# Altium project PCB_Project.PrjPcb
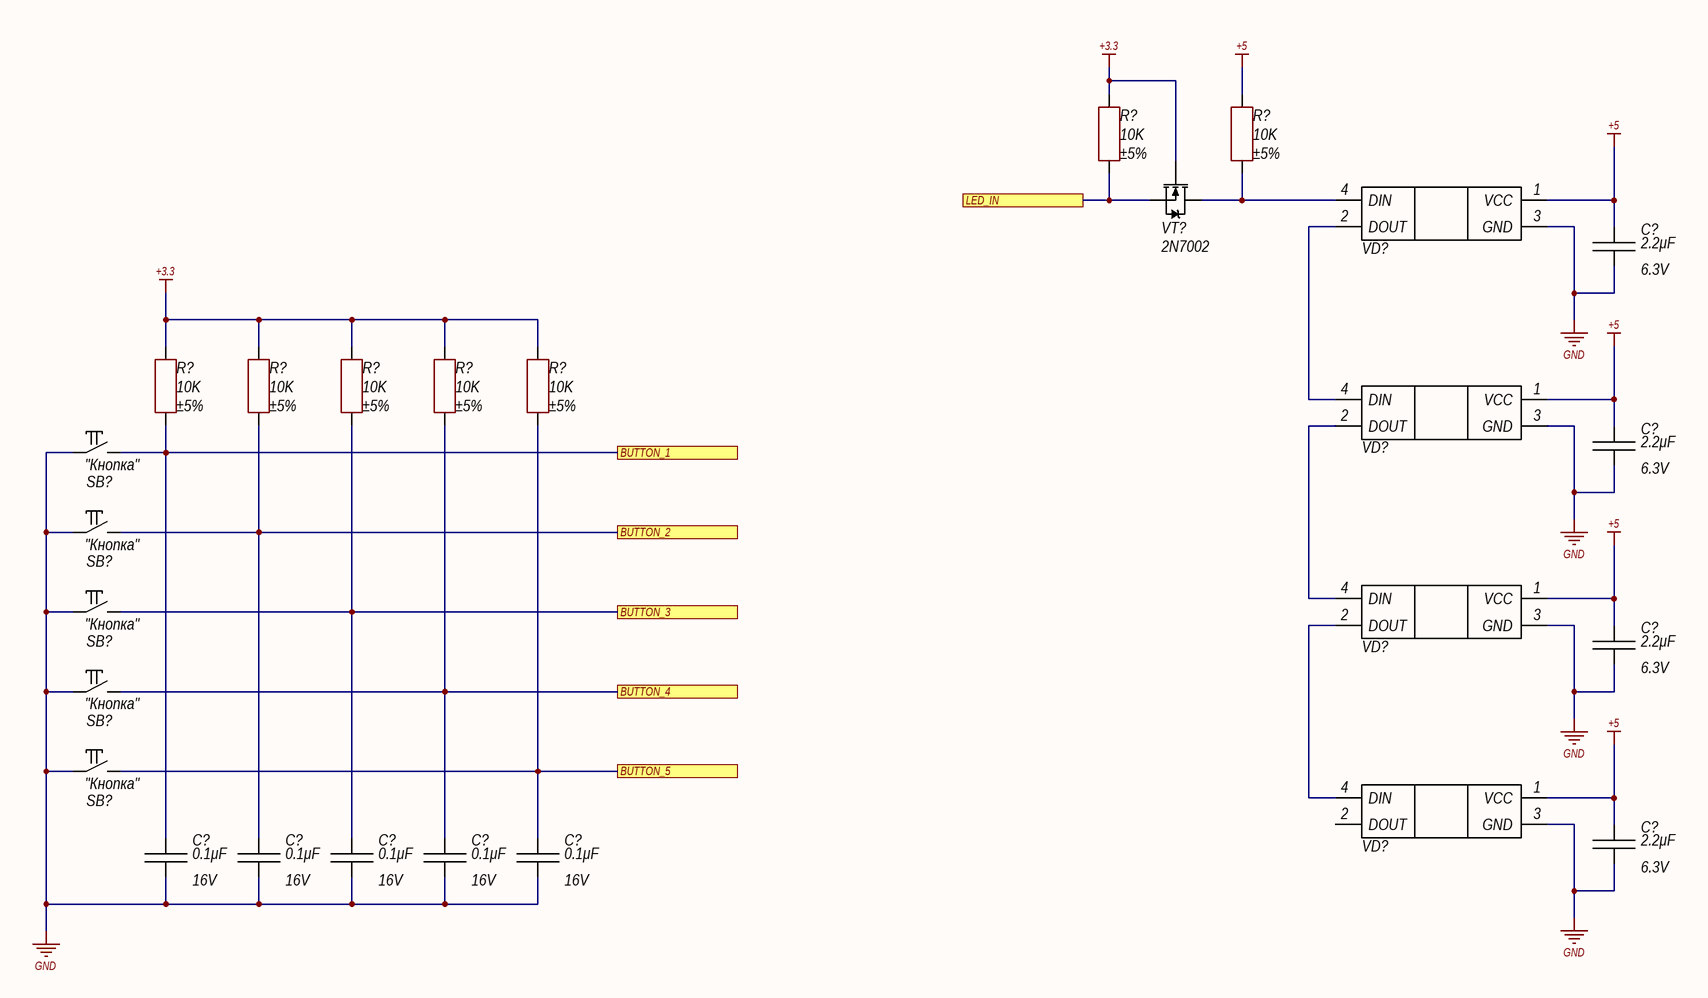
[diagram p0: Sheet1.SchDoc]
2 sheets, 27 parts. Net scope: flat (ports and power ports of the same name join across sheets).
Sheets:
  Sheet1.SchDoc
  Sheet2.SchDoc

## Sheet Sheet1.SchDoc
size 420 x 297 mm; SheetNumber: 1; SheetTotal: 1

### Parts
(Parts that share a designator on the sheet are numbered #1, #2 ... from top to bottom, then left to right.)
C?#1  value 2.2μF  Voltage: 6.3V  [CAP: 0402]
C?#2  value 2.2μF  Voltage: 6.3V  [CAP: 0402]
C?#3  value 2.2μF  Voltage: 6.3V  [CAP: 0402]
C?#4  value 2.2μF  Voltage: 6.3V  [CAP: 0402]
C?#5  value 0.1μF  Voltage: 16V  [CAP: 0402]
C?#6  value 0.1μF  Voltage: 16V  [CAP: 0402]
C?#7  value 0.1μF  Voltage: 16V  [CAP: 0402]
C?#8  value 0.1μF  Voltage: 16V  [CAP: 0402]
C?#9  value 0.1μF  Voltage: 16V  [CAP: 0402]
R?#1  value 10K  Tolerance: ±5%  [RES: 0402]
R?#2  value 10K  Tolerance: ±5%  [RES: 0402]
R?#3  value 10K  Tolerance: ±5%  [RES: 0402]
R?#4  value 10K  Tolerance: ±5%  [RES: 0402]
R?#5  value 10K  Tolerance: ±5%  [RES: 0402]
R?#6  value 10K  Tolerance: ±5%  [RES: 0402]
R?#7  value 10K  Tolerance: ±5%  [RES: 0402]
SB?#1  CommentText: "Кнопка"  [BUT: 5X5 SMD]
SB?#2  CommentText: "Кнопка"  [BUT: 5X5 SMD]
SB?#3  CommentText: "Кнопка"  [BUT: 5X5 SMD]
SB?#4  CommentText: "Кнопка"  [BUT: 5X5 SMD]
SB?#5  CommentText: "Кнопка"  [BUT: 5X5 SMD]
VD?#1  (no value)  [WS2812B]
VD?#2  (no value)  [WS2812B]
VD?#3  (no value)  [WS2812B]
VD?#4  (no value)  [WS2812B]
VT?  PartNumber: 2N7002  [SOT23]

### Ports
BUTTON_1, BUTTON_2, BUTTON_3, BUTTON_4, BUTTON_5, LED_IN

### Nets
+3.3: R?#1.2 R?#3.2 R?#4.2 R?#5.2 R?#6.2 R?#7.2 VT?.1(G)
+5: C?#1.2 C?#2.2 C?#3.2 C?#4.2 R?#2.2 VD?#1.1(VCC) VD?#2.1(VCC) VD?#3.1(VCC) VD?#4.1(VCC)
GND: C?#1.1 C?#2.1 C?#3.1 C?#4.1 C?#5.1 C?#6.1 C?#7.1 C?#8.1 C?#9.1 SB?#1.1 SB?#2.1 SB?#3.1 SB?#4.1 SB?#5.1 VD?#1.3(GND) VD?#2.3(GND) VD?#3.3(GND) VD?#4.3(GND)
NetC?#5_2: C?#5.2 R?#3.1 SB?#1.2 ; port BUTTON_1
NetC?#6_2: C?#6.2 R?#4.1 SB?#2.2 ; port BUTTON_2
NetC?#7_2: C?#7.2 R?#5.1 SB?#3.2 ; port BUTTON_3
NetC?#8_2: C?#8.2 R?#6.1 SB?#4.2 ; port BUTTON_4
NetC?#9_2: C?#9.2 R?#7.1 SB?#5.2 ; port BUTTON_5
NetR?#1_1: R?#1.1 VT?.3(S) ; port LED_IN
NetR?#2_1: R?#2.1 VD?#1.4(DIN) VT?.2(D)
NetVD?#1_2: VD?#1.2(DOUT) VD?#2.4(DIN)
NetVD?#2_2: VD?#2.2(DOUT) VD?#3.4(DIN)
NetVD?#3_2: VD?#3.2(DOUT) VD?#4.4(DIN)

Not connected (* = marked no-connect by the designer): VD?#4 2(DOUT)

### Notes on the sheet
- Перв. примен.
- Справ. №
- Подп. и дата
- Инв. № дубл.
- Взам. инв. №
- Разраб.
- Изм.
- Лист
- № докум.
- Подп.
- Дата
- Лит.
- Масса
- Масштаб
- Пров.
- Т.контр.
- Листов
- Инв. № подл.
- Утв.
- Н.контр.
- 2.106-A3
- Копировал
- Формат А3

### Library data of the parts
C?#1-C?#4 = Ceramic_0402: Manufacturer: Yageo; PartNumber: CC0402KRX7R7BB104; ValueManufacturerPartNumber: Ceramic capacitor, 2.2μF, X7R, ±10%, 6.3V, 0402, -55...+125°C; TypeCapacitor: Ceramic capacitor; Tolerance: ±10%; TypeDielectric: X7R; Package: 0402; HelpURL: https://www.digikey.com/product-detail/en/yageo/CC0402KRX7R7BB104/311-1338-1-ND/2103122; Temperature: -55...+125°C
C?#5-C?#9 = Ceramic_0402: Manufacturer: Yageo; PartNumber: CC0402KRX7R7BB104; ValueManufacturerPartNumber: Ceramic capacitor, 0.1μF, X7R, ±10%, 16V, 0402, -55...+125°C; TypeCapacitor: Ceramic capacitor; Tolerance: ±10%; TypeDielectric: X7R; Package: 0402; HelpURL: https://www.digikey.com/product-detail/en/yageo/CC0402KRX7R7BB104/311-1338-1-ND/2103122; Temperature: -55...+125°C
R?#1-R?#7 = Resistor_0402: Manufacturer: Yageo; PartNumber: RC0402JR-07100RL; ValueManufacturerPartNumber: Resistor film, 10K, ±5%, 0402, 0.063W, -55...+125°C; TypeResistor: Resistor film; Power: 0.063W; Package: 0402; HelpURL: https://www.digikey.com/product-detail/en/yageo/RC0402JR-07100RL/311-100JRCT-ND/729362; Temperature: -55...+125°C
SB?#1-SB?#5 = Button_tactile: Manufacturer: TE Connectivity; ValueManufacturerPartNumber: Tactile button, 6x6mm; PartNumber: FSM2JSMAATR; TypeButton: Tactile button; HelpURL: https://www.digikey.com/product-detail/en/te-connectivity-alcoswitch-switches/FSM2JSMAATR/450-1792-1-ND/3503931; Package: 6x6mm
VD?#1-VD?#4 = WS2812B: ADDRESS LED DISCRETE SERIAL; Manufacturer: world-semi; ValueManufacturerPartNumber: LED, WS2812B, *, *, WS2812B, -55...+150°C; Package: WS2812B; HelpURL: https://cdn-shop.adafruit.com/datasheets/WS2812.pdf; Temperature: -55...+150°C; TypeDiode: LED; Current: *; VoltageDrop: *; PartNumber: *; ColorParameter: WS2812B
VT? = MOSFET_N_123: Транзистор полевой 2N7002 (YJ) / N-канал, SOT-23, 0.27А, 60В; Manufacturer: YJ (Yangzhou Yangjie); HelpURL: https://belchip.by/product/?selected_product=48215

## Sheet Sheet2.SchDoc
size 420 x 297 mm; SheetNumber: 2; SheetTotal: 2
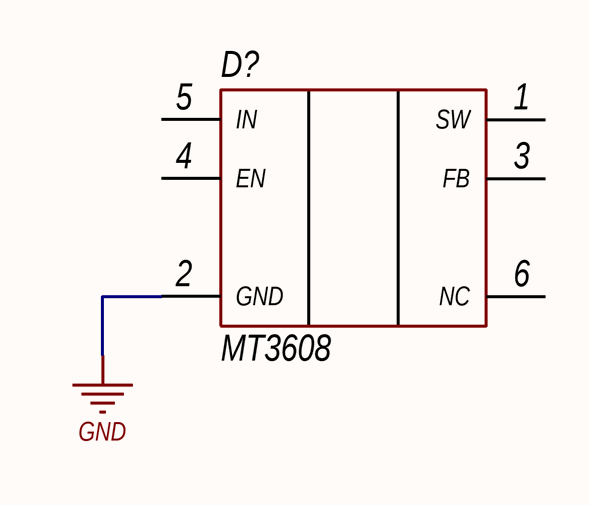
[diagram p1: Sheet2.SchDoc]

### Parts
D?  (no value)  [SOT23-6]

### Nets
GND: D?.2(GND)

Not connected (* = marked no-connect by the designer): D? 1(SW) 3(FB) 4(EN) 5(IN) 6(NC)

### Notes on the sheet
- Подп. и дата
- Инв. № дубл.
- Взам. инв. №
- Инв. № подл.
- Изм.
- Лист
- № докум.
- Подп.
- Дата
- 2.106-A3
- Копировал
- Формат А3

### Library data of the parts
D? = MT3608: Step Up Converter; HelpURL: https://www.olimex.com/Products/Breadboarding/BB-PWR-3608/resources/MT3608.pdf; Package: SOT23-6; ComponentType: High Efficiency 1.2MHz; ValueManufacturerPartNumber: =ComponentType+', '+VoltageInput+', '+MaxDropout+', '+VoltageOutput+', '+CurrentOutput+', '+Temperature+', '+Package; Temperature: -40...+85°C; PartNumber: MT3608

## Nets that join several sheets
GND: Sheet1 (18 pins), Sheet2 (D?.2)